# Altium schematic sheet USB2.0.SchDoc
size 431 x 279 mm; SheetNumber: 2; SheetTotal: 4
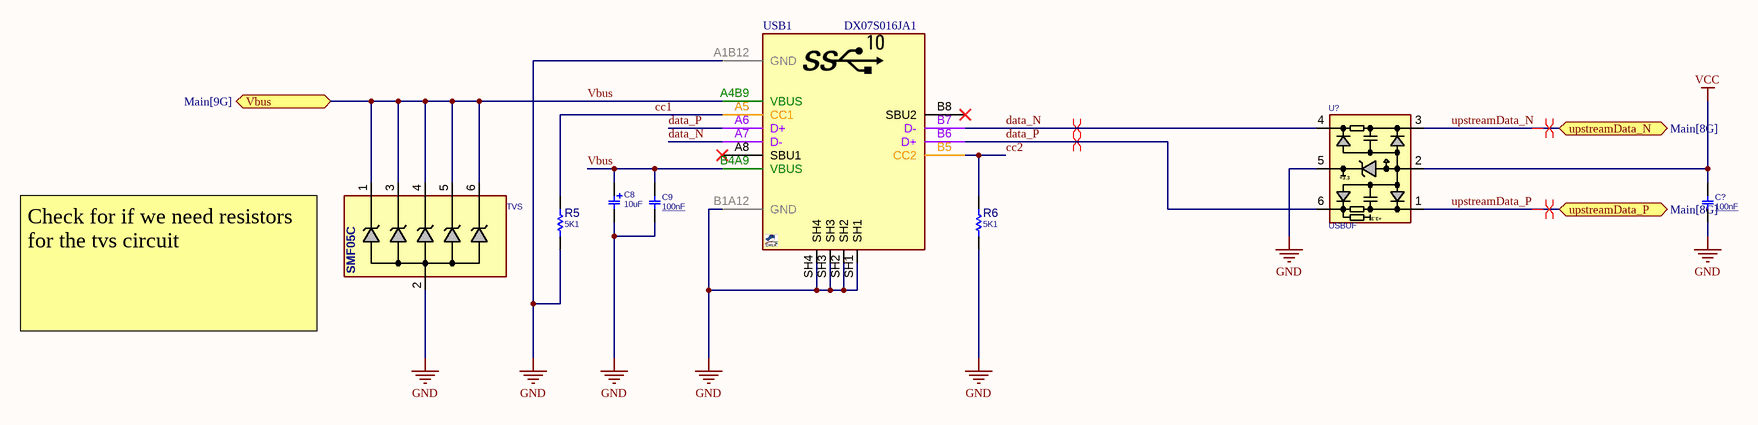
[diagram p0: USB2.0.SchDoc]

## Parts
C8  10uF  [C_TN_3528]
C9  100nF  [C0805]
C?  100nF  [C0805]
R5  5K1  [R0805]
R6  5K1  [R0805]
TVS  TVS_SMF05C  [SOT363_6]  (value not drawn)
U?  USBUF  [SOT363_6]
USB1  DX07S016JA1  [USBC_SMD_16_DX07S016JA1]

## Ports
upstreamData_N (bidir, see Main[8G]), upstreamData_P (bidir, see Main[8G]), Vbus (bidir, see Main[9G])

## Nets
GND: C8.2 C9.2 C?.2 R5.1 R6.1 TVS.2 U?.5 USB1.A1B12(GND) USB1.B1A12(GND) USB1.SH1 USB1.SH2 USB1.SH3 USB1.SH4
VCC: C?.1 U?.2
cc1: R5.2 USB1.A5(CC1)
cc2: R6.2 USB1.B5(CC2)
data_N: U?.4 USB1.A7(D-) USB1.B7(D-)
data_P: U?.6 USB1.A6(D+) USB1.B6(D+)
upstreamData_N: U?.3 ; port upstreamData_N
upstreamData_P: U?.1 ; port upstreamData_P
Vbus: C8.1 C9.1 TVS.1 TVS.3 TVS.4 TVS.5 TVS.6 USB1.A4B9(VBUS) USB1.B4A9(VBUS) ; port Vbus

Not connected (* = marked no-connect by the designer): USB1 A8(SBU1)* B8(SBU2)*

## Layout directives
differential pair: data_N, data_P, upstreamData_N, upstreamData_P

## Notes on the sheet
- Check for if we need resistors for the tvs circuit
- DWG. NO.
- REV.
- SHT.
- THIS DOCUMENT AND THE DATA DISCLOSED HEREIN OR HEREWITH IS THE PROPERTY OF ALTIUM LIMITED AND MAY BE FREELY DISTRIBUTED IN WHOLE. NO RIGHTS ARE RESERVED OR EXPRESS OR IMPLIED WARANTEE GIVEN.
- REVISION
- DESCRIPTION
- DATE
- APPROVED
- ENG:
- APPROVALS
- PROJECT
- DSN:
- CHK:
- REFERENCE DOCUMENTS
- PROJECT REVISION:
- TITLE
- DOCUMENT REVISION:
- DESIGN ITEM:
- BOM:
- FAB DWG:
- PCB DWG:
- ASSY DWG:
- SCALE:
- SIZE
- B
- CAGE CODE
- FILE NAME
- DWG NO.
- SHEET
- OF
- REV
- (in symbol TVS_X2_USBUF_SOT363) +3.3
- (in symbol TVS_X5_SMF05C) SMF05C

## Library data of the parts
C8 = CAP_SMD_TAN_3528: CAP, SMD, TAN,; PARAM2: 6.3V; VALUE: 10uF
C9 C? = CAP_SMD_MLCC_0805: CAP, MLCC, 100nF, 50V,0805; PARAM: -, -%; MANF_P#: MANF_PART#; PRICE: 100= 1$; MANF: -; PARAM2: 50V; ASSEMBLY: ASSEMBLY; VALUE: 100nF
R5 R6 = RES_SMD_0805: RESISTOR, SMD; PARAM: 0.125W; DESC: DESCRIPTION; DIST#: MOUSER; PARAM2: 10%; MANF_P#: -; MANF: -; ASSEMBLY: ASSEMBLY; PRICE: 100= 0.5$; VALUE: 5K1
TVS = TVS_X5_SMF05C: TVS, ESD PROTECT, 5CH, 5VRWM, 15KV; MANF_P#: SMF05C, SMF05CT1G; MANF: Semtech, ON; PARAM: 5VRWM, 15KV; VALUE: TVS_SMF05C
U? = TVS_X2_USBUF_SOT363: TVS, ESD PROTECT, 3CH; MANF_P#: USBUF02W6, USBUF01W6; MANF: ST; VALUE: USBUF
USB1 = CONN_USBC_SMD_16_DX07S016JA1: CONN, USB, Type C, USB 2.0, Right-Angle, SMD; MANF: JAE; MANF_P#: DX07S016JA1R1500; PARAM: 5A; Price: 1.5$; Value: DX07S016JA1